# EAGLE design main board128 (EAGLE 7.2.0)
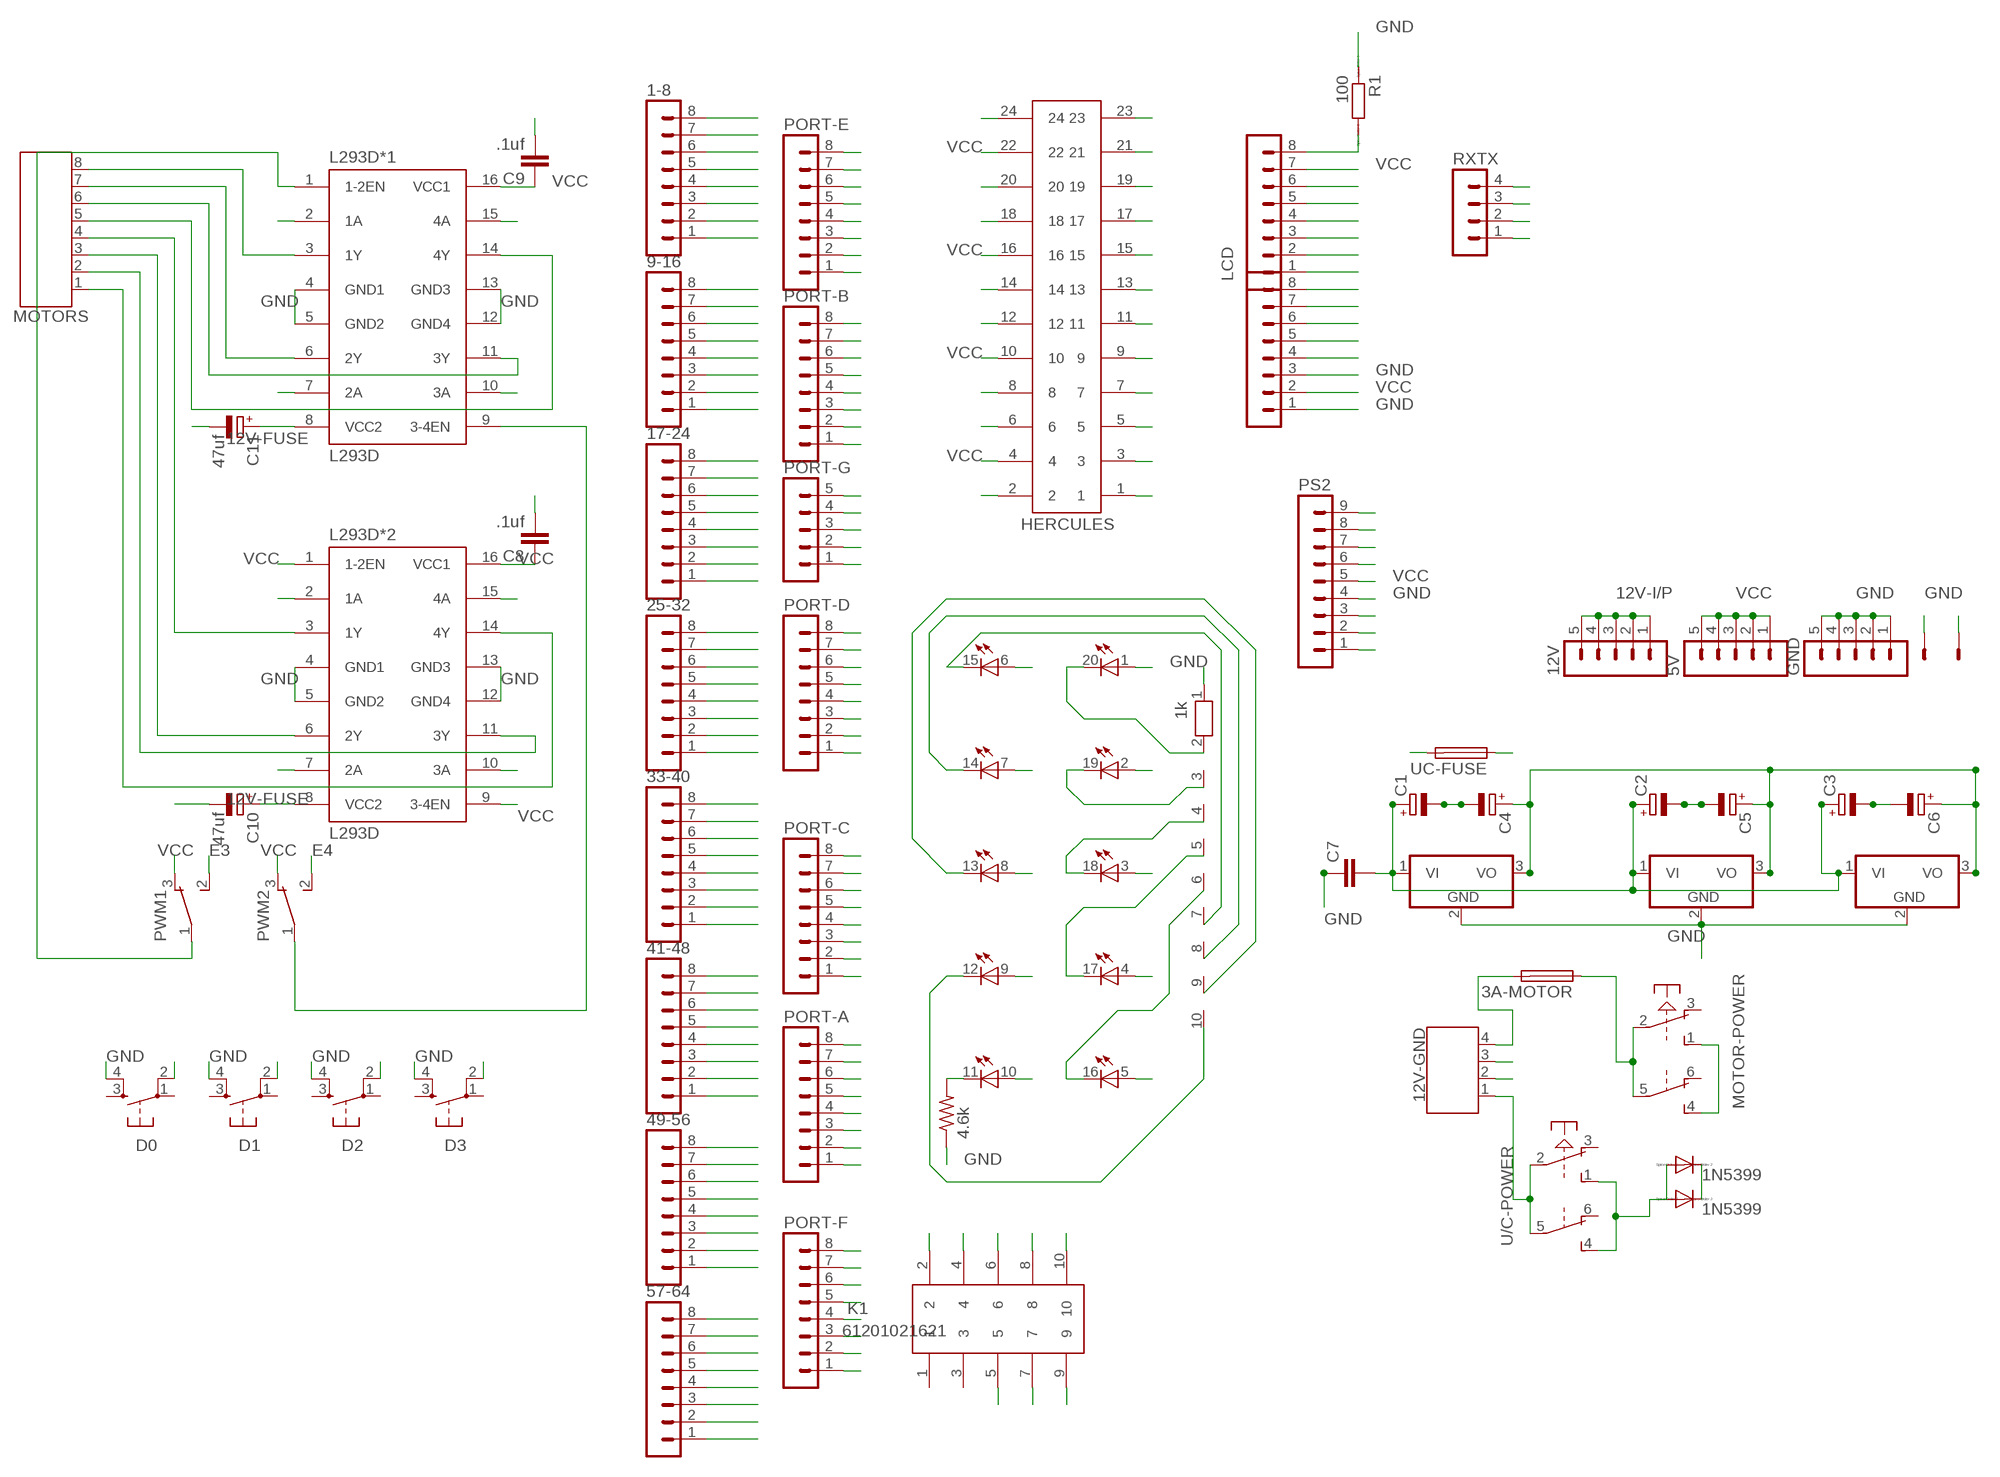
[diagram p0: schematic, sheet 1]

## Parts
1-8  MA08-1  [MA08-1]
3A-MOTOR  SH25  [SH25]
5V  MA05-1  [MA05-1]
9-16  MA08-1  [MA08-1]
12V  MA05-1  [MA05-1]
12V-GND  691131710004  [691131710004]
17-24  MA08-1  [MA08-1]
25-32  MA08-1  [MA08-1]
33-40  MA08-1  [MA08-1]
41-48  MA08-1  [MA08-1]
49-56  MA08-1  [MA08-1]
57-64  MA08-1  [MA08-1]
7805-1  7805T  [TO220H]
7805-2  7805T  [TO220H]
7805-3  7805T  [TO220H]
BASEMOTORSLED  LB10  [LB10]
C1  CPOL-EUE2.5-5  [E2,5-5]
C2  CPOL-EUE2.5-5  [E2,5-5]
C3  CPOL-EUE2.5-5  [E2,5-5]
C4  CPOL-EUE2.5-5  [E2,5-5]
C5  CPOL-EUE2.5-5  [E2,5-5]
C6  CPOL-EUE2.5-5  [E2,5-5]
C7  C5/2.5  [C5B2.5]
C8  .1uf  C5/2.5  [C5B2.5]
C9  .1uf  C5/2.5  [C5B2.5]
C10  47uf  CPOL-EUE2.5-5  [E2,5-5]
C11  47uf  CPOL-EUE2.5-5  [E2,5-5]
D0  DTS-6  [DTS-6]
D1  DTS-6  [DTS-6]
D2  DTS-6  [DTS-6]
D3  DTS-6  [DTS-6]
GND  MA05-1  [MA05-1]
HERCULES  61202421621  [61202421621]
K1  61201021621  [61201021621]
L293D*1  L293D  [DIL16]
L293D*2  L293D  [DIL16]
LCD  MA08-1  [MA08-1]
LCD*  MA08-1  [MA08-1]
MOTOR-POWER  PVA2R  [PVA2R]
MOTORS  691131710008  [691131710008]
PORT-A  MA08-1  [MA08-1]
PORT-B  MA08-1  [MA08-1]
PORT-C  MA08-1  [MA08-1]
PORT-D  MA08-1  [MA08-1]
PORT-E  MA08-1  [MA08-1]
PORT-F  MA08-1  [MA08-1]
PORT-G  MA05-1  [MA05-1]
POWER-D1  1N5399  1N5060GP  [DO15-12]
POWER-D2  1N5399  1N5060GP  [DO15-12]
PS2  MA09-1  [MA09-1]
PWM1  450301014042  [450301014042]
PWM2  450301014042  [450301014042]
R1  100  R0204/7  [0204/7]
R2  4.6k  R-US_0204/5  [0204/5]
RN1  1k  RN09  [RN-10]
RXTX  MA04-1  [MA04-1]
SENSOR-POWER  KK-156-2  [KK-156-2]
U/C-POWER  PVA2R  [PVA2R]
UC-FUSE  SH25  [SH25]

## Nets
1: 1-8.1
12V: 7805-1.1(VI) 7805-2.1(VI) 7805-3.1(VI) BASEMOTORSLED.10(-10:A) C1.+ C2.+ C3.+ C7.2 POWER-D1.C POWER-D2.C
12V-FUSE: C10.+ C11.+ L293D*1.8(VCC2) L293D*2.8(VCC2) MOTOR-POWER.1(1:S) MOTOR-POWER.4(2:S)
12V-I/P: 3A-MOTOR.2 12V-GND.1 12V-GND.4 12V.1 12V.2 12V.3 12V.4 12V.5 U/C-POWER.2(1:P) U/C-POWER.5(2:P)
62: 57-64.6
A0: 49-56.3 LCD.3 PORT-A.1
A1: 49-56.2 LCD.4 PORT-A.2
A2: 49-56.1 LCD.5 PORT-A.3
A3: 41-48.8 LCD.6 PORT-A.4
A4: 41-48.7 PORT-A.5
A5: 41-48.6 LCD*.4 PORT-A.6
A6: 41-48.5 LCD*.5 PORT-A.7
A7: 41-48.4 LCD*.6 PORT-A.8
B0: 9-16.2 L293D*2.2(1A) PORT-B.1
B1: 9-16.3 L293D*2.7(2A) PORT-B.2
B2: 9-16.4 L293D*2.10(3A) PORT-B.3
B3: 9-16.5 L293D*2.15(4A) PORT-B.4
B4: 9-16.6 HERCULES.3 PORT-B.5
B5: 9-16.7 HERCULES.9 PORT-B.6
B6: 9-16.8 HERCULES.15 PORT-B.7
B7: 17-24.1 HERCULES.21 PORT-B.8
C0: 33-40.3 BASEMOTORSLED.1(-1:A) HERCULES.1 PORT-C.1
C1: 33-40.4 BASEMOTORSLED.2(-2:A) HERCULES.5 PORT-C.2
C2: 33-40.5 BASEMOTORSLED.3(-3:A) HERCULES.7 PORT-C.3
C3: 33-40.6 BASEMOTORSLED.4(-4:A) HERCULES.11 PORT-C.4
C4: 33-40.7 BASEMOTORSLED.5(-5:A) HERCULES.13 PORT-C.5
C5: 33-40.8 BASEMOTORSLED.6(-6:A) HERCULES.17 PORT-C.6
C6: 41-48.1 BASEMOTORSLED.7(-7:A) HERCULES.19 PORT-C.7
C7: 41-48.2 BASEMOTORSLED.8(-8:A) HERCULES.23 PORT-C.8
D0: 25-32.1 D0.2 HERCULES.2 PORT-D.1
D1: 25-32.2 D1.2 HERCULES.6 PORT-D.2
D2: 25-32.3 D2.2 HERCULES.8 PORT-D.3 RXTX.3
D3: 25-32.4 D3.2 HERCULES.12 PORT-D.4 RXTX.4
D4: 25-32.5 HERCULES.14 PORT-D.5
D5: 25-32.6 HERCULES.18 PORT-D.6
D6: 25-32.7 HERCULES.20 PORT-D.7
D7: 25-32.8 HERCULES.24 PORT-D.8
E0: 1-8.2 L293D*1.2(1A) PORT-E.1 RXTX.1
E1: 1-8.3 L293D*1.7(2A) PORT-E.2 RXTX.2
E2: 1-8.4 PORT-E.3
E3: 1-8.5 PORT-E.4 PWM1.2
E4: 1-8.6 PORT-E.5 PWM2.2
E5: 1-8.7 PORT-E.6
E6: 1-8.8 L293D*1.10(3A) PORT-E.7
E7: 9-16.1 L293D*1.15(4A) PORT-E.8
F0: 57-64.5 K1.2 PORT-F.1
F1: 57-64.4 K1.4 PORT-F.2
F2: 57-64.3 K1.6 PORT-F.3
F3: 57-64.2 K1.8 PORT-F.4
F4: 57-64.1 K1.10 PORT-F.5
F5: 49-56.8 K1.9 PORT-F.6
F6: 49-56.7 K1.7 PORT-F.7
F7: 49-56.6 K1.5 PORT-F.8
FUSE-M/C: 7805-1.3(VO) 7805-2.3(VO) 7805-3.3(VO) C4.+ C5.+ C6.+ UC-FUSE.1
G0: 33-40.1 PORT-G.1 PS2.1
G1: 33-40.2 PORT-G.2 PS2.2
G2: 41-48.3 PORT-G.3 PS2.6
G3: 17-24.2 PORT-G.4 PS2.7
G4: 17-24.3 PORT-G.5
GND: 12V-GND.2 12V-GND.3 17-24.6 49-56.5 57-64.7 7805-1.2(GND) 7805-2.2(GND) 7805-3.2(GND) C1.- C2.- C3.- C4.- C5.- C6.- C7.1 C8.2 C9.2 C10.- C11.- D0.4 D1.4 D2.4 D3.4 GND.1 GND.2 GND.3 GND.4 GND.5 L293D*1.4(GND1) L293D*1.5(GND2) L293D*1.12(GND4) L293D*1.13(GND3) L293D*2.4(GND1) L293D*2.5(GND2) L293D*2.12(GND4) L293D*2.13(GND3) LCD*.1 LCD*.3 PS2.4 R1.1 R2.1 RN1.1 SENSOR-POWER.2
L293D-2: L293D*2.14(4Y) MOTORS.1
MOTORSWITCH: 3A-MOTOR.1 MOTOR-POWER.2(1:P) MOTOR-POWER.5(2:P)
N$2: L293D*1.9(3-4EN) PWM2.1
N$3: PS2.9
N$7: PS2.8
N$13: POWER-D1.A POWER-D2.A U/C-POWER.1(1:S) U/C-POWER.4(2:S)
N$15: PS2.3
N$18: L293D*1.6(2Y) MOTORS.7
N$19: L293D*1.3(1Y) MOTORS.8
N$23: L293D*1.14(4Y) MOTORS.5
N$24: L293D*1.11(3Y) MOTORS.6
N$29: L293D*2.11(3Y) MOTORS.2
N$33: L293D*2.6(2Y) MOTORS.3
N$34: L293D*2.3(1Y) MOTORS.4
N$39: L293D*1.1(1-2EN) PWM1.1
N$45: BASEMOTORSLED.12(-9:C) RN1.10
N$47: BASEMOTORSLED.11(-10:C) R2.2
NC: LCD*.7
NC*: LCD*.8
NC**: LCD.1
NC***: LCD.2
RC0: BASEMOTORSLED.20(-1:C) RN1.2
RC1: BASEMOTORSLED.19(-2:C) RN1.3
RC2: BASEMOTORSLED.18(-3:C) RN1.4
RC3: BASEMOTORSLED.17(-4:C) RN1.5
RC4: BASEMOTORSLED.16(-5:C) RN1.6
RC5: BASEMOTORSLED.15(-6:C) RN1.7
RC6: BASEMOTORSLED.14(-7:C) RN1.8
RC7: BASEMOTORSLED.13(-8:C) RN1.9
RESET: 17-24.4
VCC: 5V.1 5V.2 5V.3 5V.4 5V.5 17-24.5 49-56.4 57-64.8 BASEMOTORSLED.9(-9:A) C8.1 C9.1 HERCULES.4 HERCULES.10 HERCULES.16 HERCULES.22 L293D*1.16(VCC1) L293D*2.1(1-2EN) L293D*2.9(3-4EN) L293D*2.16(VCC1) LCD*.2 LCD.7 PS2.5 PWM1.3 PWM2.3 SENSOR-POWER.1 UC-FUSE.2
XTAL1: 17-24.8
XTAL2: 17-24.7
XTAL3: LCD.8 R1.2
Unconnected: D0.1 D0.3 D1.1 D1.3 D2.1 D2.3 D3.1 D3.3 K1.1 K1.3 MOTOR-POWER.3(1:O) MOTOR-POWER.6(2:O) U/C-POWER.3(1:O) U/C-POWER.6(2:O)

## Library data of the parts
1-8 9-16 17-24 25-32 33-40 41-48 49-56 57-64 LCD LCD* PORT-A PORT-B PORT-C PORT-D PORT-E PORT-F = con-lstb:MA08-1: PIN HEADER; OC_FARNELL: unknown; OC_NEWARK: unknown
3A-MOTOR UC-FUSE = fuse:SH25: FUSE HOLDER grid 25 mm, OGN0031 8211, Schurter (Buerklin); MF: SCHURTER; MPN: 0031.8211; OC_FARNELL: 1162741; OC_NEWARK: 96B9380
5V 12V GND PORT-G = con-lstb:MA05-1: PIN HEADER; OC_FARNELL: unknown; OC_NEWARK: unknown
12V-GND = Wurth_Terminal_Blocks_Connectors_rev15e:691131710004: WR-TBL Terminal block - CUU5/4 - 4 Pins;=>Code : Con_TBL_Screw_PClamp_5.00_6911317100xx_691131710004 <http://katalog.we-online.de/media/images/eican/Con_TBL_Screw_PClamp_5.00_6911317100xx_pf2.jpg> Details see: http://katalog.we-online.de/em/datasheet/6911317100xx.pdf Created 11/3/2014, Karrer Zheng 2014 (C) Wurth Elektronik
7805-1-7805-3 = gm-regulators:78*: Positive VOLTAGE REGULATOR Source: http://cache.national.com/ds/LM/LM78L05.pdf http://www.fairchildsemi.com/ds/LM/LM7805.pdf
BASEMOTORSLED = led:LB10: LED BLOCK 10-LED bar graph, DIL, Siemens
C1-C6 C10 C11 = rcl:CPOL-EU: POLARIZED CAPACITOR, European symbol
C7-C9 = capacitor-wima:C: CAPACITOR naming: grid - package width
D0 D1-D3 = switch-tact:DTS-6
HERCULES = Wurth_Elektronik_Electromechanic_Wire_to_Board_Connectors_rev15c:61202421621: WR-BHD 2.54mm Male Box Header, 24 Pins=>Code : Con_WTB_BHD_2.54_Male_THT_WS_61202421621 <http://katalog.we-online.de/media/thumbs2/eican/thb_Con_WTB_BHD_2.54_Male_THT_WS_6120xx21621_pf2.jpg> Details see: http://katalog.we-online.de/en/em/612_0xx_216_21 Created 2014-06-04, Karrer Zheng 2014 (C) Würth Elektronik
K1 = Wurth_Elektronik_Electromechanic_Wire_to_Board_Connectors_rev15c:61201021621: WR-BHD 2.54mm Male Box Header, 10 Pins=>Code : Con_WTB_BHD_2.54_Male_THT_WS_61201021621 <http://katalog.we-online.de/media/thumbs2/eican/thb_Con_WTB_BHD_2.54_Male_THT_WS_6120xx21621_pf2.jpg> Details see: http://katalog.we-online.de/en/em/612_0xx_216_21 Created 2014-06-04, Karrer Zheng 2014 (C) Würth Elektronik
L293D*1 L293D*2 = st-microelectronics:L293D: PUSH-PULL 4 CHANNEL DRIVER; MPN: L293D; OC_FARNELL: 9589619; OC_NEWARK: 56P8249
MOTOR-POWER U/C-POWER = switch-misc:PVA2R: ITT SWITCH
MOTORS = Wurth_Terminal_Blocks_Connectors_rev15e:691131710008: WR-TBL Terminal block - CUU5/8 - 8 Pins;=>Code : Con_TBL_Screw_PClamp_5.00_6911317100xx_691131710008 <http://katalog.we-online.de/media/images/eican/Con_TBL_Screw_PClamp_5.00_6911317100xx_pf2.jpg> Details see: http://katalog.we-online.de/em/datasheet/6911317100xx.pdf Created 11/3/2014, Karrer Zheng 2014 (C) Wurth Elektronik
POWER-D1 POWER-D2 = diode:1N5060GP: DIODE controlled avalanche rectifier
PS2 = con-lstb:MA09-1: PIN HEADER; OC_FARNELL: unknown; OC_NEWARK: unknown
PWM1 PWM2 = Wurth_Elektronik_Electromechanic_Switch_rev15g:450301014042: WS-SHT, 10mm*2.5mm, SPDT, ON-ON, 2.54mm, straight type, THT, Mini Slide Switch, 3 pins
R1 = eagle-ltspice:R: RESISTOR, European symbol; SPICEMODEL: NONE; SPICEPREFIX: R
R2 = rcl:R-US_: RESISTOR, American symbol
RN1 = resistor-net:RN09: RESISTOR NETWORK; OC_FARNELL: unknown; OC_NEWARK: unknown
RXTX = con-lstb:MA04-1: PIN HEADER; OC_FARNELL: unknown; OC_NEWARK: unknown
SENSOR-POWER = con-molex:KK-156-2: KK 156 HEADER Source: http://www.molex.com/pdm_docs/sd/026604100_sd.pdf; OC_FARNELL: unknown; OC_NEWARK: unknown

## Net classes
0 default: clearance 0.205 mm

## Board
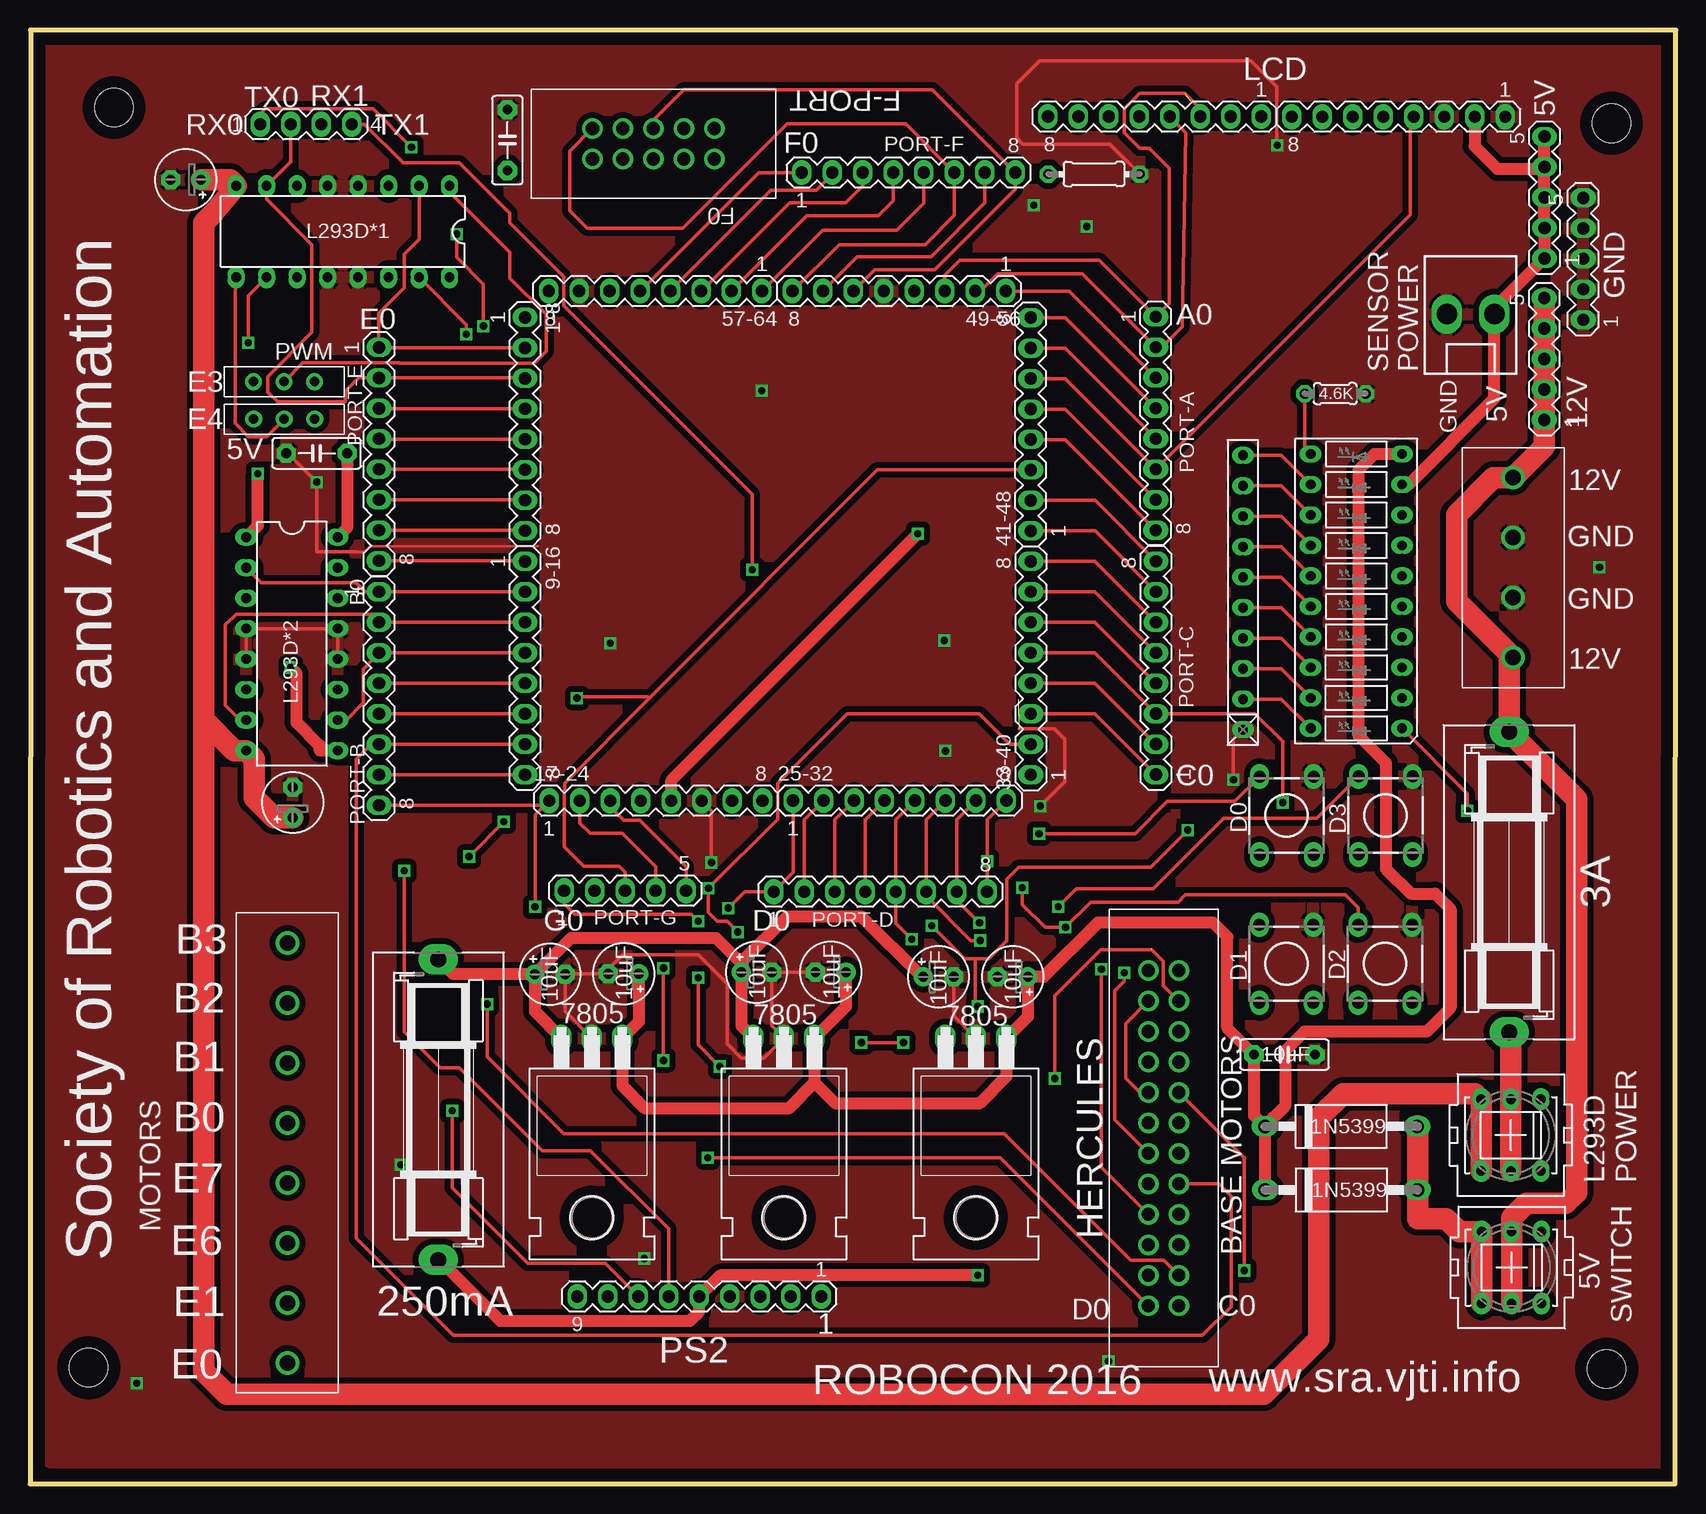
[diagram p1: board, top side]
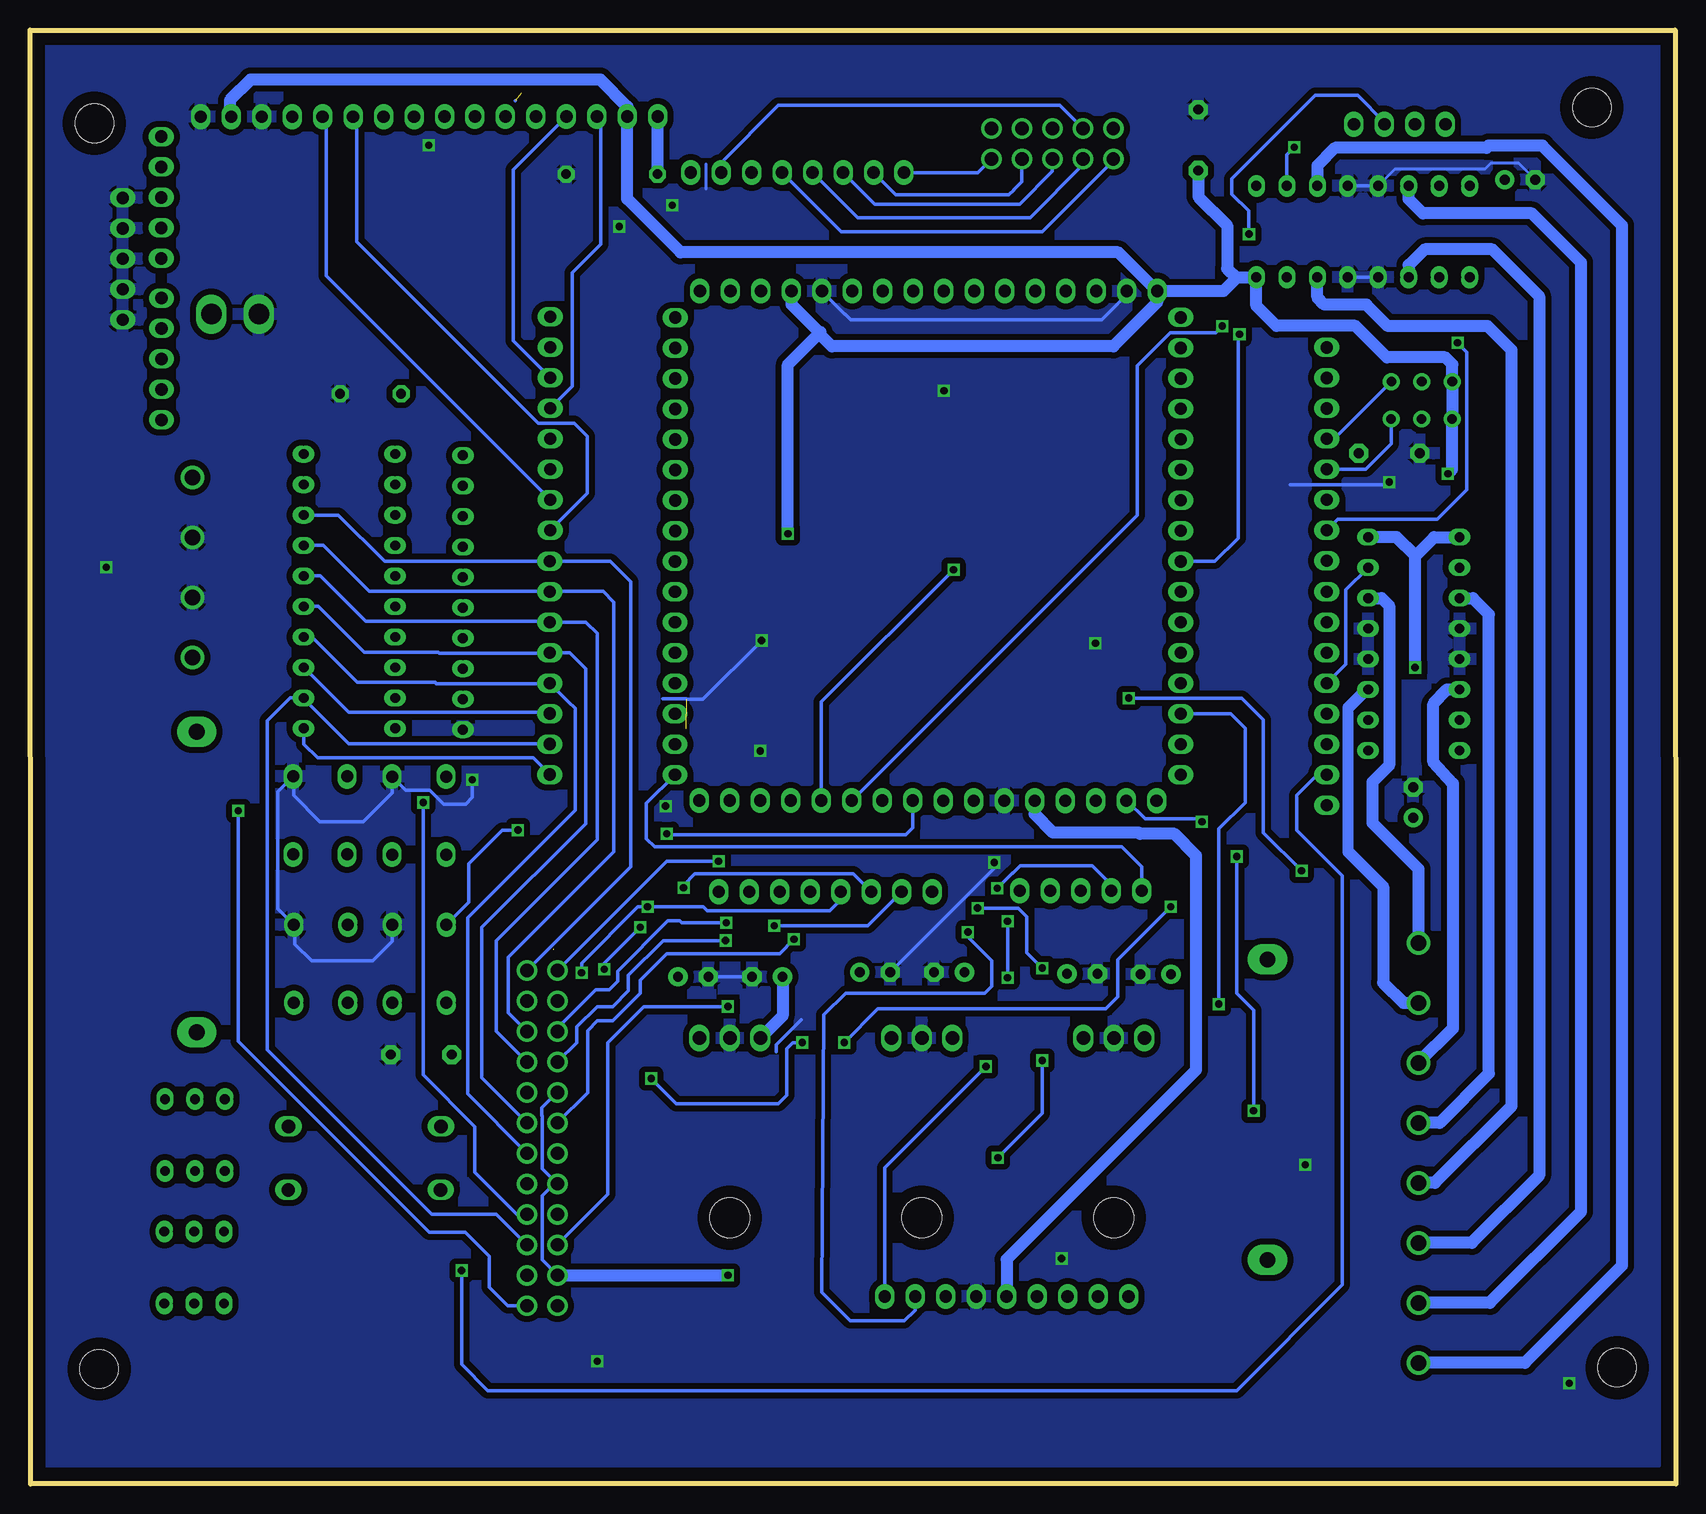
[diagram p2: board, bottom side, seen from below]

Size 137.15 x 121.15 mm. Coordinates in mm from the lower left corner, seen from the top.
Outline: 0,0 137.1,0 137.15,121.15 0.05,121.15 0,0
Copper layers (1*16): Top 0.035mm / dielectric 1.5mm / Bottom 0.035mm
Design rules "main board128 *": minimum track width 10mil, minimum drill 10mil, track to track 0.5mm, track to pad 0.25mm, pad to pad 0.35mm, via to via 0.25mm, smd to smd 8mil, copper to edge 40mil, drill to drill 8mil, minimum pad ring 0.3mm, minimum via ring 8mil, stop-mask expansion 4mil, vias tented up to drill 0mil, thermal gap 10mil
Holes 3.2 mm at 4.89,9.68 131.39,9.57 131.79,113.38 7,114.69

### Footprints (pad centres in the part's own frame; a part is rotated, then mirrored left to right if it is on the bottom)
MA08-1 = drill 1.016 long: 1 -8.89,0; 2 -6.35,0; 3 -3.81,0; 4 -1.27,0; 5 1.27,0; 6 3.81,0; 7 6.35,0; 8 8.89,0
SH25 = drill 1.321 pad 2.54 long: 1 -12.522,0; 2 12.522,0
MA05-1 = drill 1.016 long: 1 -5.08,0; 2 -2.54,0; 3 0,0; 4 2.54,0; 5 5.08,0
691131710004 = drill 1.3: 1 -7.5,0; 2 -2.5,0; 3 2.5,0; 4 7.5,0
TO220H = drill 1.118 long: 1 -2.54,-10.16; 2 0,-10.16; 3 2.54,-10.16 | hole 3.302: 0,4.826
LB10 = drill 0.813 long: 1 -11.43,-3.81; 2 -8.89,-3.81; 3 -6.35,-3.81; 4 -3.81,-3.81; 5 -1.27,-3.81; 6 1.27,-3.81; 7 3.81,-3.81; 8 6.35,-3.81; 9 8.89,-3.81; 10 11.43,-3.81; 11 11.43,3.81; 12 8.89,3.81; 13 6.35,3.81; 14 3.81,3.81; 15 1.27,3.81; 16 -1.27,3.81; 17 -3.81,3.81; 18 -6.35,3.81; 19 -8.89,3.81; 20 -11.43,3.81
E2,5-5 = drill 0.813 pad 1.6: + -1.27,0 | drill 0.813 pad 1.6 octagon: - 1.27,0
C5B2.5 = drill 0.813 pad 1.6 octagon: 1 -2.54,0; 2 2.54,0
DTS-6 = drill 1 long: 1 -3.25,2.25; 2 3.25,2.25; 3 -3.25,-2.25; 4 3.25,-2.25
61202421621 = drill 1.1: 1 -2.54,-1.27; 2 -2.54,1.27; 3 0,-1.27; 4 0,1.27; 5 2.54,-1.27; 6 2.54,1.27; 7 5.08,-1.27; 8 5.08,1.27; 9 7.62,-1.27; 10 7.62,1.27; 11 10.16,-1.27; 12 10.16,1.27; 13 12.7,-1.27; 14 12.7,1.27; 15 15.24,-1.27; 16 15.24,1.27; 17 17.78,-1.27; 18 17.78,1.27; 19 20.32,-1.27; 20 20.32,1.27; 21 22.86,-1.27; 22 22.86,1.27; 23 25.4,-1.27; 24 25.4,1.27
61201021621 = drill 1.1: 1 -2.54,-1.27; 2 -2.54,1.27; 3 0,-1.27; 4 0,1.27; 5 2.54,-1.27; 6 2.54,1.27; 7 5.08,-1.27; 8 5.08,1.27; 9 7.62,-1.27; 10 7.62,1.27
DIL16 = drill 0.813 long: 1 -8.89,-3.81; 2 -6.35,-3.81; 3 -3.81,-3.81; 4 -1.27,-3.81; 5 1.27,-3.81; 6 3.81,-3.81; 7 6.35,-3.81; 8 8.89,-3.81; 9 8.89,3.81; 10 6.35,3.81; 11 3.81,3.81; 12 1.27,3.81; 13 -1.27,3.81; 14 -3.81,3.81; 15 -6.35,3.81; 16 -8.89,3.81
PVA2R = drill 0.813 long: 1 -2.997,2.489; 2 -2.997,0; 3 -2.997,-2.489; 4 2.997,2.489; 5 2.997,0; 6 2.997,-2.489
691131710008 = drill 1.3: 1 -17.5,0; 2 -12.5,0; 3 -7.5,0; 4 -2.5,0; 5 2.5,0; 6 7.5,0; 7 12.5,0; 8 17.5,0
DO15-12 = drill 1.118 long: A 6.35,0; C -6.35,0
MA09-1 = drill 1.016 long: 1 -10.16,0; 2 -7.62,0; 3 -5.08,0; 4 -2.54,0; 5 0,0; 6 2.54,0; 7 5.08,0; 8 7.62,0; 9 10.16,0
450301014042 = drill 0.8: 1 0,0; 2 -2.54,0; 3 2.54,0
0204/7 = drill 0.813 octagon: 1 -3.81,0; 2 3.81,0
0204/5 = drill 0.813 octagon: 1 -2.54,0; 2 2.54,0
RN-10 = drill 0.813 long: 1 -11.43,0; 2 -8.89,0; 3 -6.35,0; 4 -3.81,0; 5 -1.27,0; 6 1.27,0; 7 3.81,0; 8 6.35,0; 9 8.89,0; 10 11.43,0
MA04-1 = drill 1.016 long: 1 -3.81,0; 2 -1.27,0; 3 1.27,0; 4 3.81,0
KK-156-2 = drill 1.7 pad 2.184 long: 1 -1.98,0; 2 1.98,0

### Placement (x,y rotation side)
1-8  41.26,88.3 270 top
3A-MOTOR  123.27,50.14 90 top
5V  126.21,107.19 90 top
9-16  41.26,67.97 270 top
12V  126.19,93.73 90 top
12V-GND  123.6,76.34 270 top
17-24  52.16,56.92 0 top
25-32  72.48,56.93 0 top
33-40  83.4,67.97 90 top
41-48  83.39,88.3 90 top
49-56  72.43,99.39 180 top
57-64  52.11,99.39 180 top
7805-1  46.83,26.98 180 top
7805-2  62.83,26.98 180 top
7805-3  78.83,26.98 180 top
BASEMOTORSLED  110.53,74.38 90 top
C1  49.47,42.49 180 top
C2  66.73,42.63 180 top
C3  81.89,42.24 180 top
C4  43.34,42.46 0 top
C5  60.55,42.63 0 top
C6  75.71,42.24 0 top
C7  104.54,35.77 180 top
C8  39.79,111.97 90 top
C9  23.89,85.88 180 top
C10  21.89,56.77 90 top
C11  12.99,108.67 180 top
D0  104.72,55.68 90 top
D1  104.71,43.33 90 top
D2  112.92,43.33 90 top
D3  112.97,55.7 90 top
GND  129.43,102.08 90 top
HERCULES  94.47,17.38 90 top
K1  54.49,111.67 180 top
L293D*1  26.07,104.36 180 top
L293D*2  21.83,70 270 top
LCD  93.72,113.94 180 top
LCD*  114.04,113.92 180 top
MOTOR-POWER  123.41,29.05 90 top
MOTORS  21.45,27.57 270 top
PORT-A  93.81,88.36 270 top
PORT-B  29.08,65.45 270 top
PORT-C  93.83,68 90 top
PORT-D  70.87,49.34 0 top
PORT-E  29.08,85.8 270 top
PORT-F  73.21,109.27 0 top
PORT-G  49.59,49.42 0 top
POWER-D1  109.26,29.79 0 top
POWER-D2  109.28,24.48 0 top
PS2  55.77,15.61 180 top
PWM1  21.17,91.84 180 top
PWM2  21.18,88.72 180 top
R1  88.67,109.14 180 top
R2  108.77,90.84 180 top
RN1  101.08,74.28 90 top
RXTX  23.01,113.3 0 top
SENSOR-POWER  120.06,97.47 180 top
U/C-POWER  123.47,18.02 90 top
UC-FUSE  34.03,31.18 270 top

### Tracks (layer width: path | path; a pad name or v marks a point on that pad's centre or on a via)
12V
  Top 1.016: POWER-D1.C 102.91,24.5 POWER-D2.C | POWER-D1.C 102,30.7 C7.2 99.79,37.97 99.79,45.57 98.59,46.77 88.99,46.77 84.46,42.24 C3.+ 83.16,38.93 7805-3.1 81.37,33.95 79.09,31.68 67.15,31.68 65.37,33.45 | BASEMOTORSLED.10 112.03,85.81 110.69,84.47 110.69,62.38 112.99,60.07 112.99,51.27 115.09,49.17 117.09,49.17 118.39,47.88 118.39,39.67 116.39,37.67 106.19,37.67 104.59,36.07 104.59,31.46 POWER-D1.C | C2.+ 68,39.77 7805-2.1 65.37,33.45 | C1.+ 50.74,38.52 7805-1.1 49.39,37.12 49.39,33.17 51.29,31.28 63.19,31.28 65.37,33.45
12V-FUSE
  Top 1.778: MOTOR-POWER.1 MOTOR-POWER.4 120.45,32.52 109.44,32.52 107.41,30.5 107.41,12.06 102.82,7.47 16.39,7.47 14.47,9.39 14.47,63.67 | 14.47,63.67 14.47,105.1 15.34,105.97 L293D*1.8 16.67,108.67 C11.+ | C10.+ 20.36,55.5 18.69,57.17 18.69,60.44 L293D*2.8 17.04,61.11 14.47,63.67
12V-I/P
  Top 1.778: U/C-POWER.2 U/C-POWER.5 123.47,22.16 124.69,23.38 127.99,23.38 128.89,24.28 128.89,57.05 3A-MOTOR.2 123.27,68.52 12V-GND.4 118.89,73.55 118.89,80.77 121.96,83.84 12V-GND.1 126.19,86.44 12V.1 12V.2 12V.3 12V.4 12V.5
A0  (1 unrouted)
  Top 0.305: 49-56.3 76.24,100.72 77.49,101.97 79.32,101.97 79.33,101.97 89.1,101.97 PORT-A.1 94.95,98.39 94.95,109.64 93.29,111.3 92.47,111.3 91.19,112.58 91.19,114.61 92.47,115.88 96.23,115.88 97.53,114.58 LCD.3
  Bottom 0.305: 96.7,115.27 96.71,115.27
A1
  Top 0.305: 49-56.2 79.2,99.39 80.63,100.83 87.7,100.83 PORT-A.2 94.31,94.72 96.02,96.42 96.32,112.61 LCD.4
A2
  Top 0.305: 49-56.1 86.59,99.39 PORT-A.3
  Bottom 0.305: PORT-A.3 96.89,95.25 96.89,109.49 LCD.5
A3
  Top 0.305: 41-48.8 86.26,97.19 PORT-A.4
  Bottom 0.305: PORT-A.4 91.98,91.47 91.98,100.91 89.61,103.28 89.61,113.63 LCD.6
A4
  Top 0.305: 41-48.7 86.26,94.64 PORT-A.5
A5
  Top 0.305: 41-48.6 86.26,92.11 PORT-A.6 115.01,105.75 115.01,113.62 LCD*.4
A6
  Top 0.305: 41-48.5 86.26,89.56 PORT-A.7
  Bottom 0.305: PORT-A.7 112.47,100.67 112.47,113.62 LCD*.5
A7
  Top 0.305: 41-48.4 86.26,87.02 PORT-A.8
  Bottom 0.305: PORT-A.8 90.72,82.56 90.72,87.31 91.78,88.38 94.79,88.38 109.93,103.52 109.93,113.62 LCD*.6
B0
  Top 0.305: 9-16.2 41.25,74.33 PORT-B.1 27.91,74.33 27.91,74.36 27.19,75.08 19.29,75.08 L293D*2.2
B1
  Top 0.305: 9-16.3 41.25,71.8 PORT-B.2 29.08,71.99 28.6,72.47 17.19,72.47 16.29,71.58 16.29,64.88 17.52,63.65 L293D*2.7
B2
  Top 0.305: 9-16.4 41.25,69.25 PORT-B.3 27.79,67.86 27.79,65.08 26.36,63.65 L293D*2.10
B3
  Top 0.305: PORT-B.4 41.25,66.72 9-16.5
  Bottom 0.305: L293D*2.15 27.49,74.5 27.49,68.31 PORT-B.4
B4  (via drill 0.6)
  Top 0.305: PORT-B.5 41.25,64.17 9-16.6 | v38.09,39.97 38.09,35.57 44.49,29.18 81.19,29.18 91.71,18.65 94.46,18.65 HERCULES.3
  Bottom 0.305: v38.09,39.97 38.09,54.57 35.89,56.77 35.89,62.97 37.08,64.16 9-16.6
B5
  Top 0.305: 9-16.7 41.25,61.63 PORT-B.6 28.45,61.63 27.19,60.38 27.19,20.48 35.29,12.38 97.69,12.38 100.09,14.77 100.09,23.98 99.07,25 HERCULES.9
B6  (via drill 0.6)
  Top 0.305: PORT-B.7 41.25,59.09 9-16.8 | HERCULES.15 101.19,27.16 v101.19,17.77
  Bottom 0.305: v101.19,17.77 101.19,9.97 98.99,7.78 36.59,7.78 27.79,16.57 27.79,50.67 31.59,54.47 31.59,57.38 29.88,59.09 PORT-B.7
B7  (via drill 0.6)  (1 unrouted)
  Top 0.305: PORT-B.8 42.91,56.55 17-24.1 42.09,55.74 v42.09,48.07 | v69.29,36.77 v72.79,36.77 | v85.39,33.77 85.39,40.67 89.21,44.5 93.49,44.5 94.45,43.54 94.45,41.51 HERCULES.21
  Bottom 0.305: v42.09,48.07 46.49,43.67 46.49,40.57 47.49,39.57 66.49,39.57 v69.29,36.77 | v72.79,36.77 73.59,36.77 74.09,36.27 74.09,32.38 74.79,31.68 83.29,31.68 v85.39,33.77
C0  (via drill 0.6)
  Top 0.305: 33-40.3 88.75,64.19 PORT-C.1 | v119.79,56.07 119.79,57.51 BASEMOTORSLED.1
  Bottom 0.305: HERCULES.1 97.35,14.84 98.89,16.38 98.89,18.98 100.89,20.98 103.89,20.98 119.79,36.88 v119.79,56.07 | BASEMOTORSLED.1 114.34,61.65 113.19,60.49 95.22,60.49 PORT-C.1
C1
  Top 0.305: 33-40.4 88.75,66.72 PORT-C.2
  Bottom 0.305: PORT-C.2 93.86,61.67 110.59,61.67 114.34,65.43 BASEMOTORSLED.2 115.47,65.49 117.39,63.57 117.39,36.17 103.69,22.48 98.3,22.48 HERCULES.5
C2  (via drill 0.6)
  Top 0.305: 33-40.5 88.75,69.27 PORT-C.3 102.08,64.19 104.39,61.88 v104.39,56.77
  Bottom 0.305: BASEMOTORSLED.3 110.59,64.28 93.92,64.28 PORT-C.3 | HERCULES.7 96.57,22.46 100.09,25.98 100.09,29.78 104.39,34.07 v104.39,56.77
C3
  Top 0.305: 33-40.6 88.75,71.8 PORT-C.4
  Bottom 0.305: BASEMOTORSLED.4 113.69,70.57 109.89,66.78 103.39,66.78 103.29,66.67 93.88,66.67 PORT-C.4 92.29,65.19 92.28,65.19 91.72,64.62 91.72,56.14 100.69,47.17 100.69,32.48 HERCULES.11
C4
  Top 0.305: 33-40.7 88.75,74.34 PORT-C.5
  Bottom 0.305: BASEMOTORSLED.5 113.13,73.11 109.3,69.29 103.13,69.29 103.05,69.21 93.88,69.21 PORT-C.5 92.18,69.27 90.84,67.92 90.84,55.02 99.49,46.38 99.49,33.82 HERCULES.13
C5
  Top 0.305: 33-40.8 88.75,76.88 PORT-C.6
  Bottom 0.305: BASEMOTORSLED.6 112.97,75.65 109.19,71.88 93.9,71.88 PORT-C.6 90.82,71.8 89.89,70.88 89.89,53.67 98.29,45.27 98.29,37.7 HERCULES.17
C6
  Top 0.305: 41-48.1 88.77,79.41 PORT-C.7
  Bottom 0.305: BASEMOTORSLED.7 112.71,78.19 108.89,74.38 93.86,74.38 | 93.86,74.38 PORT-C.7 | HERCULES.19 97.29,39.24 97.29,43.88 88.49,52.67 88.49,73.47 89.39,74.38 93.86,74.38
C7
  Top 0.305: 41-48.2 88.77,81.94 PORT-C.8
  Bottom 0.305: BASEMOTORSLED.8 111.45,80.73 107.59,76.88 107.58,76.88 PORT-C.8 88.8,76.88 87.09,75.17 87.09,51.42 HERCULES.23
D0  (via drill 0.6)
  Top 0.305: 25-32.1 63.59,50.95 PORT-D.1 59.56,49.34 v58.19,47.97 | v84.09,54.17 92.09,54.17 94.79,56.88 100.41,56.88 D0.2 | HERCULES.2 80.86,27.18 v56.49,27.18 | v52.79,35.27 v52.79,42.97
  Bottom 0.305: 25-32.1 63.58,54.67 64.18,54.07 83.99,54.07 v84.09,54.17 | v56.49,27.18 52.79,30.88 v52.79,35.27 | v52.79,42.97 54.09,44.27 54.09,47.27 54.79,47.97 v58.19,47.97
D1  (via drill 0.6)
  Top 0.305: v96.49,54.47 93.39,51.38 82.39,51.38 81.39,50.38 81.39,45.27 79.89,43.77 78.79,43.77 | 78.79,43.77 77.88,43.77 v75.14,46.52 | v78.99,39.77 78.79,39.97 78.79,43.77 | 25-32.2 64.52,55.32 PORT-D.2
  Bottom 0.305: D1.2 100.59,48.45 100.59,51.67 97.79,54.47 v96.49,54.47 | HERCULES.6 88.99,24.12 88.99,36.77 85.99,39.77 v78.99,39.77 | PORT-D.2 67.35,46.52 v75.14,46.52
D2  (via drill 0.6)
  Top 0.305: HERCULES.8 89.29,26.37 v89.29,42.88 | v37.79,96.47 37.79,99.97 35.57,102.19 v35.57,104.14 | v82.69,49.67 82.69,48.27 84.59,46.38 v86.29,46.38 88.39,48.47 95.69,48.47 96.29,49.07 109.59,49.07 110.67,47.99 D2.2 | 25-32.3 67.06,55.32 PORT-D.3
  Bottom 0.305: 25-32.3 44.89,80.72 44.89,93.17 42.14,95.92 38.34,95.92 v37.79,96.47 | RXTX.3 24.28,113.47 26.51,115.69 30.05,115.69 30.67,115.08 30.69,115.08 36.99,108.77 36.99,107.47 35.59,106.08 35.59,104.16 v35.57,104.14 | v89.29,42.88 89.29,43.38 v86.29,46.38 | v82.69,49.67 82.69,49.88 81.74,50.82 68.54,50.82 PORT-D.3
D3  (via drill 0.6)
  Top 0.305: HERCULES.12 90.41,30.32 90.41,41.1 91.19,41.88 v91.19,42.57 | v60.19,76.17 60.19,82.47 44.49,98.17 44.49,100.58 39.99,105.08 39.99,105.88 35.79,110.08 31.09,110.08 27.86,113.3 RXTX.4 | D3.2 107.25,55.47 99.49,55.47 93.59,49.57 87.19,49.57 v85.69,48.07 | 25-32.4 69.6,55.32 PORT-D.4
  Bottom 0.305: v60.19,76.17 71.21,65.16 25-32.4 | PORT-D.4 69.6,48.66 70.5,47.77 80.72,47.77 81.03,48.07 v85.69,48.07 86.49,48.07 91.19,43.38 v91.19,42.57
D4  (via drill 0.6)
  Top 0.305: v73.49,45.38 72.14,46.72 PORT-D.5 72.14,55.32 25-32.5
  Bottom 0.305: HERCULES.14 90.69,32.59 90.69,37.77 89.89,38.57 88.59,38.57 86.29,40.88 86.29,41.97 84.09,44.17 74.69,44.17 v73.49,45.38
D5  (via drill 0.6)
  Top 0.305: v79.19,45.27 78.39,45.27 74.68,48.98 PORT-D.6 74.68,55.32 25-32.6
  Bottom 0.305: HERCULES.18 91.59,36.77 91.59,38.07 89.89,39.77 88.59,39.77 87.29,41.07 87.29,42.38 84.39,45.27 v79.19,45.27
D6  (via drill 0.6)
  Top 0.305: 25-32.7 77.22,55.32 PORT-D.7 77.22,48.64 v79.12,46.74
  Bottom 0.305: HERCULES.20 93.2,37.96 89.99,41.17 88.89,41.17 88.19,41.88 88.19,42.7 83.99,46.9 83.02,46.9 82.86,46.74 v79.12,46.74
D7  (via drill 0.6)
  Top 0.305: PORT-D.8 v79.77,51.88 79.77,55.33 25-32.8
  Bottom 0.305: HERCULES.24 84.1,51.88 v79.77,51.88
E0  (via drill 0.6)
  Top 0.305: 1-8.2 29.12,94.66 PORT-E.1 29.08,97.56 31.19,99.67 31.19,102.47 32.42,103.71 L293D*1.2 | v31.79,111.38 28.59,114.58 19.59,114.58 19.2,114.19 RXTX.1
  Bottom 0.305: L293D*1.2 32.42,110.74 v31.79,111.38
E1
  Top 0.305: 1-8.3 41.22,92.16 PORT-E.2 27.38,92.16 26.26,91.03 26.26,90.16 20.63,90.16 19.82,90.97 19.82,92.27 23.49,95.94 23.49,103.27 19.72,107.04 L293D*1.7 21.74,110.19 RXTX.2
E2
  Top 0.305: 1-8.4 29.12,89.58 PORT-E.3
E3
  Top 0.305: 1-8.5 29.12,87.03 PORT-E.4
  Bottom 0.305: PORT-E.4 28.48,87.08 PWM1.2
E4
  Top 0.305: PORT-E.5 41.22,84.53 1-8.6
  Bottom 0.305: PORT-E.5 25.85,84.53 23.72,86.66 PWM2.2
E5
  Top 0.305: PORT-E.6 41.22,81.99 1-8.7
E6  (via drill 0.6)
  Top 0.305: PORT-E.7 41.22,79.45 1-8.8 | v18.19,95.08 18.19,99.02 L293D*1.10
  Bottom 0.305: v18.19,95.08 17.43,94.31 17.43,82.83 19.89,80.38 28.16,80.38 PORT-E.7
E7  (via drill 0.6)
  Top 0.305: PORT-E.8 41.21,76.91 9-16.1 | L293D*1.15 36.36,96.61 v36.36,95.8
  Bottom 0.305: 40.02,76.86 9-16.1 38.42,76.86 36.47,78.81 36.47,95.69 v36.36,95.8
F0
  Top 0.305: 57-64.5 60.72,109.27 PORT-F.1
  Bottom 0.305: K1.2 58.16,109.27 PORT-F.1
F1
  Top 0.305: PORT-F.2 66.86,109.14 65.52,107.8 61.73,107.8 53.38,99.45 57-64.4
  Bottom 0.305: K1.4 54.49,108.52 55.19,107.83 55.19,107.81 55.57,107.44 65.02,107.44 PORT-F.2
F2
  Top 0.305: 57-64.3 63.3,106.77 67.99,106.77 69.4,108.19 PORT-F.3
  Bottom 0.305: K1.6 51.95,109.36 54.69,106.62 66.75,106.62 PORT-F.3
F3
  Top 0.305: 57-64.2 64.74,105.67 70.69,105.67 71.94,106.92 PORT-F.4
  Bottom 0.305: K1.8 49.41,109.91 53.79,105.52 68.19,105.52 PORT-F.4
F4
  Top 0.305: 57-64.1 66.08,104.47 72.24,104.47 74.49,106.72 PORT-F.5
  Bottom 0.305: K1.10 46.87,110.24 52.79,104.33 69.53,104.33 PORT-F.5
F5
  Top 0.305: 49-56.8 67.42,103.27 74.59,103.27 77.02,105.7 PORT-F.6 72.97,113.33 63.09,113.33 54.39,104.62 46.44,104.62 44.99,106.08 44.99,111.06 K1.9
F6
  Top 0.305: 49-56.7 68.96,102.27 75.09,102.27 79.56,106.74 PORT-F.7
  Bottom 0.305: K1.7 51.34,114.88 74.79,114.88 79.56,110.11 PORT-F.7
F7
  Top 0.305: 49-56.6 70.4,101.17 75.39,101.17 82.1,107.88 PORT-F.8 75.2,116.17 54.49,116.17 51.95,113.63 K1.5
FUSE-M/C
  Top 1.016: 7805-2.3 59.28,38.15 C5.+ 59.28,43.38 | C4.+ 42.07,39.36 7805-1.3 | C4.+ 35.26,42.46 UC-FUSE.1 | C4.+ 45.08,45.47 57.18,45.47 59.28,43.38 | C6.+ 74.32,42.24 69.29,47.27 63.09,47.27 59.28,43.46 59.28,43.38
  Bottom 1.016: C6.+ 74.44,38.99 7805-3.3
G0  (via drill 0.6)
  Top 0.305: v57.49,34.77 55.69,36.57 v55.69,42.17 | v55.69,46.88 55.09,47.47 45.39,47.47 44.51,48.35 PORT-G.1
  Bottom 0.305: PS2.1 65.93,26.34 v57.49,34.77 | PORT-G.1 44.51,51.42 46.16,53.07 85.09,53.07 85.79,53.77 85.79,56.7 33-40.1 | v55.69,42.17 v55.69,46.88
G1  (via drill 0.6)
  Top 0.305: v58.99,45.97 58.09,46.88 57.29,46.88 56.54,47.62 v56.54,49.62 62.31,55.4 62.31,58.4 68.09,64.17 79.09,64.17 81.64,61.62 33-40.2
  Bottom 0.305: PS2.2 63.39,14.48 64.29,13.57 68.79,13.57 71.19,15.98 70.99,39.07 69.19,40.88 57.59,40.88 56.99,41.47 56.99,43.57 58.99,45.57 v58.99,45.97 | v56.54,49.62 55.29,50.88 55.27,50.88 54.64,51.5 48.62,51.5 47.05,49.93 PORT-G.2
G2  (via drill 0.6)
  Top 0.305: 51.59,65.47 44.55,58.38 44.55,57.83 44.54,57.77 44.54,53.09 46.16,51.47 49.09,51.47 49.59,50.97 PORT-G.3 | 51.59,65.47 70.6,84.48 41-48.3 | v31.19,51.07 31.19,37.65 34.17,34.67 35.79,34.67 42.69,27.78 46.69,27.78 53.23,21.23 PS2.6 | 51.59,65.47 51.49,65.58 45.68,65.58 v45.58,65.47
  Bottom 0.305: v31.19,51.07 34.39,54.27 34.39,63.67 36.19,65.47 v45.58,65.47
G3  (via drill 0.6)
  Top 0.305: 45.82,56.64 17-24.2 45.81,55.05 46.67,54.2 49.36,54.2 52.13,51.42 PORT-G.4 | v36.59,52.27 v39.49,55.17 | PS2.7 47.93,18.38 41.49,18.38 35.19,24.68 v35.19,31.07
  Bottom 0.305: v36.59,52.27 36.59,40.88 35.19,39.47 v35.19,31.07 | 45.82,56.7 17-24.2 45.74,56.92 44.22,55.4 39.72,55.4 v39.49,55.17
G4
  Top 0.305: 17-24.3 48.36,56.4 49.47,55.29 50.8,55.29 54.67,51.42 PORT-G.5
GND  (via drill 0.6)  (1 unrouted)
  Top 0.254: 42.34,78.15 28.39,78.19 27.88,77.67 27.19,77.67
  Top 0.305: C6.- 76.98,38.99 7805-3.2 | C2.- C5.- 61.82,38.15 7805-2.2 61.16,35.48 59.29,35.48 58.09,36.67 58.09,41.67 55.69,44.07 49.39,44.07 48.2,42.88 C1.- 44.64,42.49 C4.- 44.61,39.36 7805-1.2 | L293D*2.12 L293D*2.13 L293D*2.4 L293D*2.5 | v100.29,58.67 100.29,62.05 RN1.1 | 27.19,77.67 23.89,77.67 v23.89,83.47 21.49,85.88 C9.2 | 82.45,62.9 85.37,62.9 86.22,62.05 86.22,58.5 v84.19,56.47 | v56.79,51.77 56.79,56.1 17-24.6 | R1.1 90,111.63 82.75,111.63 82.22,112.16 82.22,116.69 84.13,118.59 101.73,118.59 103.91,116.41 103.91,111.58 v103.93,111.55
  Bottom 0.254: 80.83,109.99 80.83,107.91 | C11.- 13.09,110.05 15.43,110.05 15.92,109.55 23.41,109.55 L293D*1.5
  Bottom 0.305: C6.- C3.- | D1.4 106.96,45.2 108.59,43.57 113.69,43.57 115.09,44.97 115.09,46.5 D2.4 116.49,47.9 116.49,57.67 D3.4 115.19,58.91 115.19,57.38 112.99,55.17 109.39,55.17 106.97,57.59 D0.4 105.83,57.79 103.82,57.79 102.67,56.64 100.85,56.64 100.29,57.2 v100.29,58.67 | 57-64.7 45.76,99.11 47.84,97.02 68.75,97.02 69.2,97.47 69.24,97.47 49-56.5 | 74.95,35.98 74.95,36.6 72.89,38.67 | C2.- 56.79,51.3 v56.79,51.77 | v76.19,70.27 81.09,65.38 82.41,65.38 82.47,65.44 84.42,65.44 | L293D*1.5 L293D*1.4 | L293D*1.12 L293D*1.13 | 32.14,83.27 28.02,83.27 27.98,83.23 24.13,83.23 v23.89,83.47
  other vias: 130.79,76.38 60.99,91.08 8.89,8.38 51.19,18.77 30.89,26.57 76.29,61.07 88.05,104.77 83.64,106.54 89.88,10.2 48.36,70.05
  pour Bottom: 1.38,119.75 1.56,1.82 135.96,1.82 135.78,119.75
  pour Top: 1.34,119.77 1.61,1.81 136.01,1.81 135.74,119.77
L293D-2
  Bottom 1.016: L293D*2.14 24.52,73.81 23.89,73.17 23.89,59.88 25.29,58.47 25.29,55.07 21.45,51.23 MOTORS.1
MOTORSWITCH
  Top 1.778: 3A-MOTOR.1 123.41,37.48 MOTOR-POWER.5 MOTOR-POWER.2
N$2
  Top 0.305: PWM2.1 19.73,87.27 18.19,87.27 17.09,88.38 17.09,100.46 L293D*1.9
N$13
  Top 1.778: U/C-POWER.1 U/C-POWER.4 119.09,21.02 118.04,22.07 115.63,22.07 POWER-D2.A 115.63,29.77
  Top 1.93: POWER-D1.A 115.63,29.77
N$18
  Bottom 1.016: MOTORS.7 15.49,15.07 7.89,22.68 7.89,101.77 11.99,105.88 21.08,105.88 22.26,107.06 L293D*1.6
N$19
  Bottom 1.016: MOTORS.8 12.59,10.07 4.49,18.18 4.49,104.88 11.12,111.5 15.6,111.5 15.77,111.33 28.41,111.33 29.21,110.53 29.21,110.52 29.88,109.85 L293D*1.3
N$23
  Bottom 1.016: MOTORS.5 20.09,25.07 13.69,31.48 13.69,94.47 15.69,96.47 23.99,96.47 25.79,98.27 29.29,98.27 29.88,98.86 L293D*1.14
N$24
  Bottom 1.016: L293D*1.11 22.26,101.55 20.93,102.88 15.29,102.88 11.39,98.97 11.39,25.68 16.99,20.07 MOTORS.6
N$29
  Bottom 0.9: 27.28,52.66 27.28,64.69
  Bottom 1.016: 25.88,66.19 L293D*2.11 25.78,66.19 27.28,64.69 | MOTORS.2 22.69,40.07 24.39,41.77 24.39,49.77 27.28,52.66
N$33
  Bottom 1.016: L293D*2.6 19.08,66.19 20.2,64.98 20.2,60.12 18.59,58.35 18.59,37.93 MOTORS.3
N$34
  Bottom 1.016: L293D*2.3 16.92,73.81 15.57,72.45 15.57,34.2 19.69,30.07 MOTORS.4
N$39
  Top 0.305: PWM1.1 22.75,93.42 30.79,93.42 30.83,93.38 42.03,93.38 43.02,94.38 43.02,97.44 39.99,100.47 39.99,102.64 34.96,107.67 L293D*1.1
N$45
  Top 0.305: RN1.10 104.29,85.71 BASEMOTORSLED.12
N$47
  Top 0.305: R2.2 106.23,86.31 BASEMOTORSLED.11
RC0
  Top 0.305: RN1.2 104.29,65.39 BASEMOTORSLED.20
RC1
  Top 0.305: RN1.3 104.29,67.93 BASEMOTORSLED.19
RC2
  Top 0.305: RN1.4 104.29,70.47 BASEMOTORSLED.18
RC3
  Top 0.305: RN1.5 104.29,73.01 BASEMOTORSLED.17
RC4
  Top 0.305: RN1.6 104.29,75.55 BASEMOTORSLED.16
RC5
  Top 0.305: RN1.7 104.29,78.09 BASEMOTORSLED.15
RC6
  Top 0.305: RN1.8 104.29,80.63 BASEMOTORSLED.14
RC7
  Top 0.305: RN1.9 104.29,83.17 BASEMOTORSLED.13
VCC  (via drill 0.6)
  Top 0.305: HERCULES.22 91.3,38.34 91.3,33.8 92.48,32.62 HERCULES.16
  Top 1.016: L293D*2.9 24.16,61.11 24.16,61.52 22.22,63.45 22.22,67.53 v21.73,68.03 | BASEMOTORSLED.9 114.89,83.27 122.04,90.42 SENSOR-POWER.1 122.04,97.94 5V.1 5V.2 | UC-FUSE.2 34.11,18.65 39.19,13.57 54.99,13.57 55.77,14.36 PS2.5 57.53,17.38 v78.99,17.38 | 17-24.5 53.44,58.62 v73.99,79.17 | L293D*2.16 26.43,79.67 C9.1 | 126.12,104.56 5V.2 | 5V.2 5V.3 5V.4 | 5V.4 5V.5 | L293D*2.1 18.99,79.86 v18.99,84.17 | LCD*.2 120.39,111.47 122.29,109.58 126.05,109.58 5V.4
  Bottom 0.305: HERCULES.16 94.49,31.32 94.49,30.68 94.47,30.66 94.47,26.27 HERCULES.10 93.47,25 94.47,23.99 94.47,18.65 HERCULES.4
  Bottom 1.016: L293D*2.1 20.14,78.89 21.71,77.31 21.73,77.33 | 21.73,77.33 23.28,78.89 L293D*2.16 | 17-24.5 53.44,55.82 51.89,54.27 44.77,54.27 44.65,54.15 41.77,54.15 39.99,52.38 39.99,34.48 55.77,18.7 PS2.5 | HERCULES.4 v78.99,17.38 | 57-64.8 37.71,99.39 36.61,100.49 | 49-56.4 73.7,98.28 71.39,95.97 71.29,95.97 71.35,95.91 | v73.99,79.17 73.99,93.27 71.35,95.91 | 36.61,100.49 36.55,100.55 L293D*1.16 34.96,98.16 33.28,96.48 26.7,96.48 24.09,93.88 19.21,93.88 18.63,93.3 PWM1.3 PWM2.3 18.64,84.52 v18.99,84.17 | C8.1 39.79,107.27 37.39,104.88 37.39,101.27 36.61,100.49 | 57-64.8 46.45,102.62 82.94,102.62 87.39,107.08 87.39,113.91 LCD.7 87.37,114.77 89.61,117.02 118.77,117.02 120.5,115.28 120.5,114.03 LCD*.2 | v21.73,68.03 21.73,77.33 | 57-64.8 43.22,98.44 46.88,94.78 70.32,94.78 71.35,95.81 71.35,95.91
XTAL3
  Bottom 1.016: R1.2 84.86,112.66 LCD.8

### Text on the board
tNames: LCD | TX0 | RX1 | F-PORT | RX0 | TX1 | 5V | F0 | F0 | GND | E0 | A0 | PWM | SENSOR / POWER | E3 | 4.6K | E4 | 5V | 12V | GND | 5V | 12V | GND | GND | B0 | 12V | C0 | 3A | B3 | G0 | D0 | B2 | 10uF | 10uF | 10uF | 10uF | 10uF | 10uF | 7805 | 7805 | 7805 | B1 | 10uF | B0 | 1N5399 | E7 | L293D / POWER | 1N5399 | E6 | BASE MOTORS | Society of Robotics and Automation | E1 | 250mA | C0 | D0 | 5V / SWITCH | 1 | E0 | ROBOCON 2016 | www.sra.vjti.info